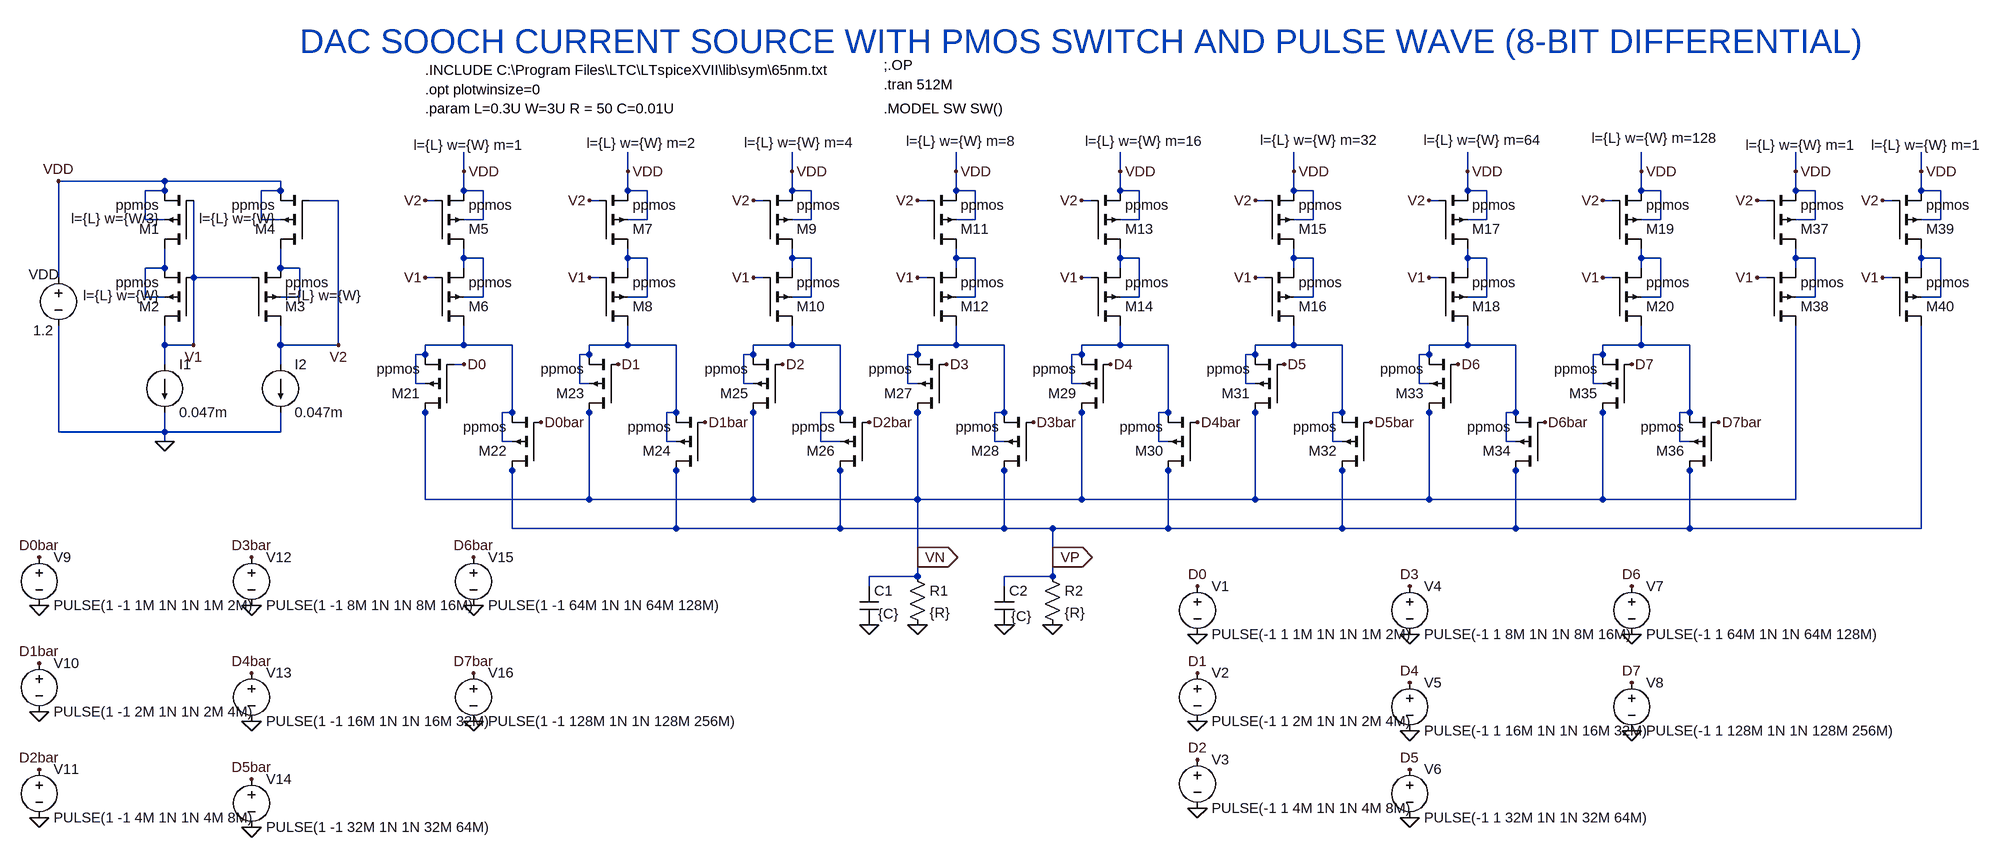
[diagram p0: schematic 106DAC_DIFF_SOOCH_PMOS_SW_PULSE_8BIT.asc]
106DAC_DIFF_SOOCH_PMOS_SW_PULSE_8BIT.asc, the LTspice schematic file:
Version 4
SHEET 1 2324 848
WIRE -512 -320 -512 -352
WIRE -240 -320 -240 -352
WIRE 32 -320 32 -352
WIRE 304 -320 304 -352
WIRE 576 -320 576 -352
WIRE 864 -320 864 -352
WIRE 1152 -320 1152 -352
WIRE 1440 -320 1440 -352
WIRE 1696 -320 1696 -352
WIRE 1904 -320 1904 -352
WIRE -1008 -304 -1184 -304
WIRE -816 -304 -1008 -304
WIRE -1008 -288 -1008 -304
WIRE -1008 -288 -1040 -288
WIRE -816 -288 -816 -304
WIRE -816 -288 -848 -288
WIRE -512 -288 -512 -320
WIRE -480 -288 -512 -288
WIRE -240 -288 -240 -320
WIRE -208 -288 -240 -288
WIRE 32 -288 32 -320
WIRE 64 -288 32 -288
WIRE 304 -288 304 -320
WIRE 336 -288 304 -288
WIRE 576 -288 576 -320
WIRE 608 -288 576 -288
WIRE 864 -288 864 -320
WIRE 896 -288 864 -288
WIRE 1152 -288 1152 -320
WIRE 1184 -288 1152 -288
WIRE 1440 -288 1440 -320
WIRE 1472 -288 1440 -288
WIRE 1696 -288 1696 -320
WIRE 1728 -288 1696 -288
WIRE 1904 -288 1904 -320
WIRE 1936 -288 1904 -288
WIRE -720 -272 -768 -272
WIRE -560 -272 -576 -272
WIRE -288 -272 -304 -272
WIRE -16 -272 -32 -272
WIRE 256 -272 240 -272
WIRE 528 -272 512 -272
WIRE 816 -272 800 -272
WIRE 1104 -272 1088 -272
WIRE 1392 -272 1376 -272
WIRE 1648 -272 1632 -272
WIRE 1856 -272 1840 -272
WIRE -1040 -240 -1040 -288
WIRE -1008 -240 -1040 -240
WIRE -848 -240 -848 -288
WIRE -816 -240 -848 -240
WIRE -480 -240 -480 -288
WIRE -480 -240 -512 -240
WIRE -208 -240 -208 -288
WIRE -208 -240 -240 -240
WIRE 64 -240 64 -288
WIRE 64 -240 32 -240
WIRE 336 -240 336 -288
WIRE 336 -240 304 -240
WIRE 608 -240 608 -288
WIRE 608 -240 576 -240
WIRE 896 -240 896 -288
WIRE 896 -240 864 -240
WIRE 1184 -240 1184 -288
WIRE 1184 -240 1152 -240
WIRE 1472 -240 1472 -288
WIRE 1472 -240 1440 -240
WIRE 1728 -240 1728 -288
WIRE 1728 -240 1696 -240
WIRE 1936 -240 1936 -288
WIRE 1936 -240 1904 -240
WIRE -512 -176 -512 -192
WIRE -480 -176 -512 -176
WIRE -240 -176 -240 -192
WIRE -208 -176 -240 -176
WIRE 32 -176 32 -192
WIRE 64 -176 32 -176
WIRE 304 -176 304 -192
WIRE 336 -176 304 -176
WIRE 576 -176 576 -192
WIRE 608 -176 576 -176
WIRE 864 -176 864 -192
WIRE 896 -176 864 -176
WIRE 1152 -176 1152 -192
WIRE 1184 -176 1152 -176
WIRE 1440 -176 1440 -192
WIRE 1472 -176 1440 -176
WIRE 1696 -176 1696 -192
WIRE 1728 -176 1696 -176
WIRE 1904 -176 1904 -192
WIRE 1936 -176 1904 -176
WIRE -1008 -160 -1008 -192
WIRE -1008 -160 -1040 -160
WIRE -816 -160 -816 -192
WIRE -784 -160 -816 -160
WIRE -512 -160 -512 -176
WIRE -240 -160 -240 -176
WIRE 32 -160 32 -176
WIRE 304 -160 304 -176
WIRE 576 -160 576 -176
WIRE 864 -160 864 -176
WIRE 1152 -160 1152 -176
WIRE 1440 -160 1440 -176
WIRE 1696 -160 1696 -176
WIRE 1904 -160 1904 -176
WIRE -1184 -144 -1184 -304
WIRE -960 -144 -960 -272
WIRE -864 -144 -960 -144
WIRE -560 -144 -576 -144
WIRE -288 -144 -304 -144
WIRE -16 -144 -32 -144
WIRE 256 -144 240 -144
WIRE 528 -144 512 -144
WIRE 816 -144 800 -144
WIRE 1104 -144 1088 -144
WIRE 1392 -144 1376 -144
WIRE 1648 -144 1632 -144
WIRE 1856 -144 1840 -144
WIRE -1040 -112 -1040 -160
WIRE -1008 -112 -1040 -112
WIRE -784 -112 -784 -160
WIRE -784 -112 -816 -112
WIRE -480 -112 -480 -176
WIRE -480 -112 -512 -112
WIRE -208 -112 -208 -176
WIRE -208 -112 -240 -112
WIRE 64 -112 64 -176
WIRE 64 -112 32 -112
WIRE 336 -112 336 -176
WIRE 336 -112 304 -112
WIRE 608 -112 608 -176
WIRE 608 -112 576 -112
WIRE 896 -112 896 -176
WIRE 896 -112 864 -112
WIRE 1184 -112 1184 -176
WIRE 1184 -112 1152 -112
WIRE 1472 -112 1472 -176
WIRE 1472 -112 1440 -112
WIRE 1728 -112 1728 -176
WIRE 1728 -112 1696 -112
WIRE 1936 -112 1936 -176
WIRE 1936 -112 1904 -112
WIRE -1008 -32 -1008 -64
WIRE -960 -32 -960 -144
WIRE -960 -32 -1008 -32
WIRE -816 -32 -816 -64
WIRE -720 -32 -720 -272
WIRE -720 -32 -816 -32
WIRE -512 -32 -512 -64
WIRE -512 -32 -576 -32
WIRE -432 -32 -512 -32
WIRE -240 -32 -240 -64
WIRE -240 -32 -304 -32
WIRE -160 -32 -240 -32
WIRE 32 -32 32 -64
WIRE 32 -32 -32 -32
WIRE 112 -32 32 -32
WIRE 304 -32 304 -64
WIRE 304 -32 240 -32
WIRE 384 -32 304 -32
WIRE 576 -32 576 -64
WIRE 576 -32 512 -32
WIRE 656 -32 576 -32
WIRE 864 -32 864 -64
WIRE 864 -32 800 -32
WIRE 944 -32 864 -32
WIRE 1152 -32 1152 -64
WIRE 1152 -32 1088 -32
WIRE 1232 -32 1152 -32
WIRE 1440 -32 1440 -64
WIRE 1440 -32 1376 -32
WIRE 1520 -32 1440 -32
WIRE -576 -16 -576 -32
WIRE -576 -16 -592 -16
WIRE -304 -16 -304 -32
WIRE -304 -16 -320 -16
WIRE -32 -16 -32 -32
WIRE -32 -16 -48 -16
WIRE 240 -16 240 -32
WIRE 240 -16 224 -16
WIRE 512 -16 512 -32
WIRE 512 -16 496 -16
WIRE 800 -16 800 -32
WIRE 800 -16 784 -16
WIRE 1088 -16 1088 -32
WIRE 1088 -16 1072 -16
WIRE 1376 -16 1376 -32
WIRE 1376 -16 1360 -16
WIRE -1008 0 -1008 -32
WIRE -816 0 -816 -32
WIRE -512 0 -528 0
WIRE -592 32 -592 -16
WIRE -576 32 -592 32
WIRE -320 32 -320 -16
WIRE -304 32 -320 32
WIRE -48 32 -48 -16
WIRE -32 32 -48 32
WIRE 224 32 224 -16
WIRE 240 32 224 32
WIRE 496 32 496 -16
WIRE 512 32 496 32
WIRE 784 32 784 -16
WIRE 800 32 784 32
WIRE 1072 32 1072 -16
WIRE 1088 32 1072 32
WIRE 1360 32 1360 -16
WIRE 1376 32 1360 32
WIRE -576 80 -576 64
WIRE -432 80 -432 -32
WIRE -432 80 -448 80
WIRE -304 80 -304 64
WIRE -160 80 -160 -32
WIRE -160 80 -176 80
WIRE -32 80 -32 64
WIRE 112 80 112 -32
WIRE 112 80 80 80
WIRE 240 80 240 64
WIRE 384 80 384 -32
WIRE 384 80 368 80
WIRE 512 80 512 64
WIRE 656 80 656 -32
WIRE 656 80 640 80
WIRE 800 80 800 64
WIRE 944 80 944 -32
WIRE 944 80 928 80
WIRE 1088 80 1088 64
WIRE 1232 80 1232 -32
WIRE 1232 80 1216 80
WIRE 1376 80 1376 64
WIRE 1520 80 1520 -32
WIRE 1520 80 1504 80
WIRE -1184 112 -1184 -64
WIRE -1008 112 -1008 80
WIRE -1008 112 -1184 112
WIRE -816 112 -816 80
WIRE -816 112 -1008 112
WIRE -1008 128 -1008 112
WIRE -448 128 -448 80
WIRE -432 128 -448 128
WIRE -176 128 -176 80
WIRE -160 128 -176 128
WIRE 80 128 80 80
WIRE 112 128 80 128
WIRE 368 128 368 80
WIRE 384 128 368 128
WIRE 640 128 640 80
WIRE 656 128 640 128
WIRE 928 128 928 80
WIRE 944 128 928 128
WIRE 1216 128 1216 80
WIRE 1232 128 1216 128
WIRE 1504 128 1504 80
WIRE 1520 128 1504 128
WIRE -432 176 -432 160
WIRE -160 176 -160 160
WIRE 112 176 112 160
WIRE 384 176 384 160
WIRE 656 176 656 160
WIRE 944 176 944 160
WIRE 1232 176 1232 160
WIRE 1520 176 1520 160
WIRE -576 224 -576 80
WIRE -304 224 -304 80
WIRE -304 224 -576 224
WIRE -32 224 -32 80
WIRE -32 224 -304 224
WIRE 240 224 240 80
WIRE 240 224 -32 224
WIRE 512 224 512 80
WIRE 512 224 240 224
WIRE 800 224 800 80
WIRE 800 224 512 224
WIRE 1088 224 1088 80
WIRE 1088 224 800 224
WIRE 1376 224 1376 80
WIRE 1376 224 1088 224
WIRE 1696 224 1696 -64
WIRE 1696 224 1376 224
WIRE -432 272 -432 176
WIRE -160 272 -160 176
WIRE -160 272 -432 272
WIRE 112 272 112 176
WIRE 112 272 -160 272
WIRE 384 272 384 176
WIRE 384 272 112 272
WIRE 464 272 384 272
WIRE 656 272 656 176
WIRE 656 272 464 272
WIRE 944 272 944 176
WIRE 944 272 656 272
WIRE 1232 272 1232 176
WIRE 1232 272 944 272
WIRE 1520 272 1520 176
WIRE 1520 272 1232 272
WIRE 1904 272 1904 -64
WIRE 1904 272 1520 272
WIRE 240 320 240 224
WIRE 464 320 464 272
WIRE 240 352 240 320
WIRE 240 352 160 352
WIRE 464 352 464 320
WIRE 464 352 384 352
WIRE 160 368 160 352
WIRE 384 368 384 352
FLAG -960 -32 V1
FLAG -576 -144 V1
FLAG -720 -32 V2
FLAG -576 -272 V2
FLAG -512 -320 VDD
FLAG -1184 -304 VDD
FLAG -304 -144 V1
FLAG -304 -272 V2
FLAG -240 -320 VDD
FLAG -32 -144 V1
FLAG -32 -272 V2
FLAG 32 -320 VDD
FLAG 240 -144 V1
FLAG 240 -272 V2
FLAG 304 -320 VDD
FLAG 512 -144 V1
FLAG 512 -272 V2
FLAG 576 -320 VDD
FLAG 800 -144 V1
FLAG 800 -272 V2
FLAG 864 -320 VDD
FLAG 1088 -144 V1
FLAG 1088 -272 V2
FLAG 1152 -320 VDD
FLAG 1376 -144 V1
FLAG 1376 -272 V2
FLAG 1440 -320 VDD
FLAG 240 432 0
FLAG -256 0 D1
FLAG 16 0 D2
FLAG 288 0 D3
FLAG 560 0 D4
FLAG 848 0 D5
FLAG 1136 0 D6
FLAG 1424 0 D7
FLAG -1008 128 0
FLAG 704 448 0
FLAG 704 592 0
FLAG 704 736 0
FLAG 1056 448 0
FLAG 1056 608 0
FLAG 704 368 D0
FLAG 704 512 D1
FLAG 704 656 D2
FLAG 1056 368 D3
FLAG 1056 528 D4
FLAG 1056 752 0
FLAG 1424 448 0
FLAG 1424 608 0
FLAG 1056 672 D5
FLAG 1424 368 D6
FLAG 1424 528 D7
FLAG 160 432 0
FLAG -1216 400 0
FLAG -1216 576 0
FLAG -1216 752 0
FLAG -864 400 0
FLAG -864 592 0
FLAG -1216 320 D0bar
FLAG -1216 496 D1bar
FLAG -1216 672 D2bar
FLAG -864 320 D3bar
FLAG -864 512 D4bar
FLAG -864 768 0
FLAG -496 400 0
FLAG -496 592 0
FLAG -864 688 D5bar
FLAG -496 320 D6bar
FLAG -496 512 D7bar
FLAG -384 96 D0bar
FLAG -112 96 D1bar
FLAG 160 96 D2bar
FLAG 432 96 D3bar
FLAG 704 96 D4bar
FLAG 992 96 D5bar
FLAG 1280 96 D6bar
FLAG 1568 96 D7bar
FLAG 464 432 0
FLAG 464 320 VP
IOPIN 464 320 Out
FLAG 384 432 0
FLAG 240 320 VN
IOPIN 240 320 Out
FLAG -512 0 D0
FLAG 1632 -144 V1
FLAG 1632 -272 V2
FLAG 1696 -320 VDD
FLAG 1840 -144 V1
FLAG 1840 -272 V2
FLAG 1904 -320 VDD
SYMBOL pmos4 -960 -192 R180
WINDOW 123 56 50 Left 2
SYMATTR Value2 l={L} w={W/3}
SYMATTR InstName M1
SYMATTR Value ppmos
SYMBOL pmos4 -960 -64 R180
WINDOW 123 56 50 Left 2
SYMATTR Value2 l={L} w={W}
SYMATTR InstName M2
SYMATTR Value ppmos
SYMBOL current -1008 0 R0
WINDOW 123 0 0 Left 0
WINDOW 39 0 0 Left 0
SYMATTR InstName I1
SYMATTR Value 0.047m
SYMBOL pmos4 -864 -64 M180
WINDOW 123 56 50 Left 2
SYMATTR Value2 l={L} w={W}
SYMATTR InstName M3
SYMATTR Value ppmos
SYMBOL pmos4 -768 -192 R180
WINDOW 123 56 50 Left 2
SYMATTR Value2 l={L} w={W}
SYMATTR InstName M4
SYMATTR Value ppmos
SYMBOL current -816 0 R0
WINDOW 123 0 0 Left 0
WINDOW 39 0 0 Left 0
SYMATTR InstName I2
SYMATTR Value 0.047m
SYMBOL pmos4 -560 -192 M180
WINDOW 123 -35 172 Left 2
SYMATTR Value2 l={L} w={W} m=1
SYMATTR InstName M5
SYMATTR Value ppmos
SYMBOL pmos4 -560 -64 M180
SYMATTR Value2 l={L} w={W} m=1
SYMATTR InstName M6
SYMATTR Value ppmos
SYMBOL voltage -1184 -160 R0
WINDOW 123 0 0 Left 0
WINDOW 39 0 0 Left 0
WINDOW 0 -49 11 Left 2
WINDOW 3 -42 104 Left 2
SYMATTR InstName VDD
SYMATTR Value 1.2
SYMBOL pmos4 -288 -192 M180
WINDOW 123 -20 175 Left 2
SYMATTR Value2 l={L} w={W} m=2
SYMATTR InstName M7
SYMATTR Value ppmos
SYMBOL pmos4 -288 -64 M180
SYMATTR Value2 l={L} w={W} m=2
SYMATTR InstName M8
SYMATTR Value ppmos
SYMBOL pmos4 -16 -192 M180
WINDOW 123 -31 176 Left 2
SYMATTR Value2 l={L} w={W} m=4
SYMATTR InstName M9
SYMATTR Value ppmos
SYMBOL pmos4 -16 -64 M180
SYMATTR Value2 l={L} w={W} m=4
SYMATTR InstName M10
SYMATTR Value ppmos
SYMBOL pmos4 256 -192 M180
WINDOW 123 -35 178 Left 2
SYMATTR Value2 l={L} w={W} m=8
SYMATTR InstName M11
SYMATTR Value ppmos
SYMBOL pmos4 256 -64 M180
SYMATTR Value2 l={L} w={W} m=8
SYMATTR InstName M12
SYMATTR Value ppmos
SYMBOL pmos4 528 -192 M180
WINDOW 123 -10 178 Left 2
SYMATTR Value2 l={L} w={W} m=16
SYMATTR InstName M13
SYMATTR Value ppmos
SYMBOL pmos4 528 -64 M180
SYMATTR Value2 l={L} w={W} m=16
SYMATTR InstName M14
SYMATTR Value ppmos
SYMBOL pmos4 816 -192 M180
WINDOW 123 -8 180 Left 2
SYMATTR Value2 l={L} w={W} m=32
SYMATTR InstName M15
SYMATTR Value ppmos
SYMBOL pmos4 816 -64 M180
SYMATTR Value2 l={L} w={W} m=32
SYMATTR InstName M16
SYMATTR Value ppmos
SYMBOL pmos4 1104 -192 M180
WINDOW 123 -25 180 Left 2
SYMATTR Value2 l={L} w={W} m=64
SYMATTR InstName M17
SYMATTR Value ppmos
SYMBOL pmos4 1104 -64 M180
SYMATTR Value2 l={L} w={W} m=64
SYMATTR InstName M18
SYMATTR Value ppmos
SYMBOL pmos4 1392 -192 M180
WINDOW 123 -34 183 Left 2
SYMATTR Value2 l={L} w={W} m=128
SYMATTR InstName M19
SYMATTR Value ppmos
SYMBOL pmos4 1392 -64 M180
SYMATTR Value2 l={L} w={W} m=128
SYMATTR InstName M20
SYMATTR Value ppmos
SYMBOL res 224 336 R0
SYMATTR InstName R1
SYMATTR Value {R}
SYMBOL voltage 704 352 R0
WINDOW 123 0 0 Left 0
WINDOW 39 0 0 Left 0
SYMATTR InstName V1
SYMATTR Value PULSE(-1 1 1M 1N 1N 1M 2M)
SYMBOL voltage 704 496 R0
SYMATTR InstName V2
SYMATTR Value PULSE(-1 1 2M 1N 1N 2M 4M)
SYMBOL voltage 704 640 R0
SYMATTR InstName V3
SYMATTR Value PULSE(-1 1 4M 1N 1N 4M 8M)
SYMBOL voltage 1056 352 R0
SYMATTR InstName V4
SYMATTR Value PULSE(-1 1 8M 1N 1N 8M 16M)
SYMBOL voltage 1056 512 R0
SYMATTR InstName V5
SYMATTR Value PULSE(-1 1 16M 1N 1N 16M 32M)
SYMBOL voltage 1056 656 R0
SYMATTR InstName V6
SYMATTR Value PULSE(-1 1 32M 1N 1N 32M 64M)
SYMBOL voltage 1424 352 R0
SYMATTR InstName V7
SYMATTR Value PULSE(-1 1 64M 1N 1N 64M 128M)
SYMBOL voltage 1424 512 R0
SYMATTR InstName V8
SYMATTR Value PULSE(-1 1 128M 1N 1N 128M 256M)
SYMBOL cap 144 368 R0
WINDOW 3 31 46 Left 2
SYMATTR Value {C}
SYMATTR InstName C1
SYMBOL voltage -1216 304 R0
WINDOW 123 0 0 Left 0
WINDOW 39 0 0 Left 0
SYMATTR InstName V9
SYMATTR Value PULSE(1 -1 1M 1N 1N 1M 2M)
SYMBOL voltage -1216 480 R0
SYMATTR InstName V10
SYMATTR Value PULSE(1 -1 2M 1N 1N 2M 4M)
SYMBOL voltage -1216 656 R0
SYMATTR InstName V11
SYMATTR Value PULSE(1 -1 4M 1N 1N 4M 8M)
SYMBOL voltage -864 304 R0
SYMATTR InstName V12
SYMATTR Value PULSE(1 -1 8M 1N 1N 8M 16M)
SYMBOL voltage -864 496 R0
SYMATTR InstName V13
SYMATTR Value PULSE(1 -1 16M 1N 1N 16M 32M)
SYMBOL voltage -864 672 R0
SYMATTR InstName V14
SYMATTR Value PULSE(1 -1 32M 1N 1N 32M 64M)
SYMBOL voltage -496 304 R0
SYMATTR InstName V15
SYMATTR Value PULSE(1 -1 64M 1N 1N 64M 128M)
SYMBOL voltage -496 496 R0
SYMATTR InstName V16
SYMATTR Value PULSE(1 -1 128M 1N 1N 128M 256M)
SYMBOL res 448 336 R0
SYMATTR InstName R2
SYMATTR Value {R}
SYMBOL cap 368 368 R0
WINDOW 3 27 50 Left 2
SYMATTR Value {C}
SYMATTR InstName C2
SYMBOL pmos4 -528 80 R180
SYMATTR Value2 l={L} w={W} m=1
SYMATTR InstName M21
SYMATTR Value ppmos
SYMBOL pmos4 -384 176 R180
SYMATTR Value2 l={L} w={W} m=1
SYMATTR InstName M22
SYMATTR Value ppmos
SYMBOL pmos4 -256 80 R180
SYMATTR Value2 l={L} w={W} m=2
SYMATTR InstName M23
SYMATTR Value ppmos
SYMBOL pmos4 16 80 R180
SYMATTR Value2 l={L} w={W} m=4
SYMATTR InstName M25
SYMATTR Value ppmos
SYMBOL pmos4 160 176 R180
SYMATTR Value2 l={L} w={W} m=4
SYMATTR InstName M26
SYMATTR Value ppmos
SYMBOL pmos4 288 80 R180
SYMATTR Value2 l={L} w={W} m=8
SYMATTR InstName M27
SYMATTR Value ppmos
SYMBOL pmos4 432 176 R180
SYMATTR Value2 l={L} w={W} m=8
SYMATTR InstName M28
SYMATTR Value ppmos
SYMBOL pmos4 -112 176 R180
SYMATTR Value2 l={L} w={W} m=2
SYMATTR InstName M24
SYMATTR Value ppmos
SYMBOL pmos4 560 80 R180
SYMATTR Value2 l={L} w={W} m=16
SYMATTR InstName M29
SYMATTR Value ppmos
SYMBOL pmos4 704 176 R180
SYMATTR Value2 l={L} w={W} m=16
SYMATTR InstName M30
SYMATTR Value ppmos
SYMBOL pmos4 848 80 R180
SYMATTR Value2 l={L} w={W} m=32
SYMATTR InstName M31
SYMATTR Value ppmos
SYMBOL pmos4 992 176 R180
SYMATTR Value2 l={L} w={W} m=32
SYMATTR InstName M32
SYMATTR Value ppmos
SYMBOL pmos4 1136 80 R180
SYMATTR Value2 l={L} w={W} m=64
SYMATTR InstName M33
SYMATTR Value ppmos
SYMBOL pmos4 1280 176 R180
SYMATTR Value2 l={L} w={W} m=64
SYMATTR InstName M34
SYMATTR Value ppmos
SYMBOL pmos4 1424 80 R180
SYMATTR Value2 l={L} w={W} m=128
SYMATTR InstName M35
SYMATTR Value ppmos
SYMBOL pmos4 1568 176 R180
SYMATTR Value2 l={L} w={W} m=128
SYMATTR InstName M36
SYMATTR Value ppmos
SYMBOL pmos4 1648 -192 M180
WINDOW 123 -35 172 Left 2
SYMATTR Value2 l={L} w={W} m=1
SYMATTR InstName M37
SYMATTR Value ppmos
SYMBOL pmos4 1648 -64 M180
SYMATTR Value2 l={L} w={W} m=1
SYMATTR InstName M38
SYMATTR Value ppmos
SYMBOL pmos4 1856 -192 M180
WINDOW 123 -35 172 Left 2
SYMATTR Value2 l={L} w={W} m=1
SYMATTR InstName M39
SYMATTR Value ppmos
SYMBOL pmos4 1856 -64 M180
SYMATTR Value2 l={L} w={W} m=1
SYMATTR InstName M40
SYMATTR Value ppmos
TEXT -576 -488 Left 2 !.INCLUDE C:\\Program Files\\LTC\\LTspiceXVII\\lib\\sym\\65nm.txt
TEXT -576 -456 Left 2 !.opt plotwinsize=0
TEXT 184 -496 Left 2 !;.OP
TEXT -576 -424 Left 2 !.param L=0.3U W=3U R = 50 C=0.01U
TEXT 184 -464 Left 2 !.tran 512M
TEXT 184 -424 Left 2 !.MODEL SW SW()
TEXT -784 -536 Left 5 ;DAC SOOCH CURRENT SOURCE WITH PMOS SWITCH AND PULSE WAVE (8-BIT DIFFERENTIAL)

The netlist it stands for:
* 106DAC_DIFF_SOOCH_PMOS_SW_PULSE_8BIT.asc
M1 N011 V1 VDD VDD ppmos l={L} w={W/3}
M2 V1 V1 N011 N011 ppmos l={L} w={W}
I1 V1 0 0.047m
M3 V2 V1 N012 N012 ppmos l={L} w={W}
M4 N012 V2 VDD VDD ppmos l={L} w={W}
I2 V2 0 0.047m
M5 N001 V2 VDD VDD ppmos l={L} w={W} m=1
M6 N013 V1 N001 N001 ppmos l={L} w={W} m=1
VDD VDD 0 1.2
M7 N002 V2 VDD VDD ppmos l={L} w={W} m=2
M8 N014 V1 N002 N002 ppmos l={L} w={W} m=2
M9 N003 V2 VDD VDD ppmos l={L} w={W} m=4
M10 N015 V1 N003 N003 ppmos l={L} w={W} m=4
M11 N004 V2 VDD VDD ppmos l={L} w={W} m=8
M12 N016 V1 N004 N004 ppmos l={L} w={W} m=8
M13 N005 V2 VDD VDD ppmos l={L} w={W} m=16
M14 N017 V1 N005 N005 ppmos l={L} w={W} m=16
M15 N006 V2 VDD VDD ppmos l={L} w={W} m=32
M16 N018 V1 N006 N006 ppmos l={L} w={W} m=32
M17 N007 V2 VDD VDD ppmos l={L} w={W} m=64
M18 N019 V1 N007 N007 ppmos l={L} w={W} m=64
M19 N008 V2 VDD VDD ppmos l={L} w={W} m=128
M20 N020 V1 N008 N008 ppmos l={L} w={W} m=128
R1 VN 0 {R}
V1 D0 0 PULSE(-1 1 1M 1N 1N 1M 2M)
V2 D1 0 PULSE(-1 1 2M 1N 1N 2M 4M)
V3 D2 0 PULSE(-1 1 4M 1N 1N 4M 8M)
V4 D3 0 PULSE(-1 1 8M 1N 1N 8M 16M)
V5 D4 0 PULSE(-1 1 16M 1N 1N 16M 32M)
V6 D5 0 PULSE(-1 1 32M 1N 1N 32M 64M)
V7 D6 0 PULSE(-1 1 64M 1N 1N 64M 128M)
V8 D7 0 PULSE(-1 1 128M 1N 1N 128M 256M)
C1 VN 0 {C}
V9 D0bar 0 PULSE(1 -1 1M 1N 1N 1M 2M)
V10 D1bar 0 PULSE(1 -1 2M 1N 1N 2M 4M)
V11 D2bar 0 PULSE(1 -1 4M 1N 1N 4M 8M)
V12 D3bar 0 PULSE(1 -1 8M 1N 1N 8M 16M)
V13 D4bar 0 PULSE(1 -1 16M 1N 1N 16M 32M)
V14 D5bar 0 PULSE(1 -1 32M 1N 1N 32M 64M)
V15 D6bar 0 PULSE(1 -1 64M 1N 1N 64M 128M)
V16 D7bar 0 PULSE(1 -1 128M 1N 1N 128M 256M)
R2 VP 0 {R}
C2 VP 0 {C}
M21 VN D0 N013 N013 ppmos l={L} w={W} m=1
M22 VP D0bar N013 N013 ppmos l={L} w={W} m=1
M23 VN D1 N014 N014 ppmos l={L} w={W} m=2
M25 VN D2 N015 N015 ppmos l={L} w={W} m=4
M26 VP D2bar N015 N015 ppmos l={L} w={W} m=4
M27 VN D3 N016 N016 ppmos l={L} w={W} m=8
M28 VP D3bar N016 N016 ppmos l={L} w={W} m=8
M24 VP D1bar N014 N014 ppmos l={L} w={W} m=2
M29 VN D4 N017 N017 ppmos l={L} w={W} m=16
M30 VP D4bar N017 N017 ppmos l={L} w={W} m=16
M31 VN D5 N018 N018 ppmos l={L} w={W} m=32
M32 VP D5bar N018 N018 ppmos l={L} w={W} m=32
M33 VN D6 N019 N019 ppmos l={L} w={W} m=64
M34 VP D6bar N019 N019 ppmos l={L} w={W} m=64
M35 VN D7 N020 N020 ppmos l={L} w={W} m=128
M36 VP D7bar N020 N020 ppmos l={L} w={W} m=128
M37 N009 V2 VDD VDD ppmos l={L} w={W} m=1
M38 VN V1 N009 N009 ppmos l={L} w={W} m=1
M39 N010 V2 VDD VDD ppmos l={L} w={W} m=1
M40 VP V1 N010 N010 ppmos l={L} w={W} m=1
.model NMOS NMOS
.model PMOS PMOS
.lib standard.mos
.INCLUDE C:\Program Files\LTC\LTspiceXVII\lib\sym\65nm.txt
.opt plotwinsize=0
;.OP
.param L=0.3U W=3U R = 50 C=0.01U
.tran 512M
.MODEL SW SW()
* DAC SOOCH CURRENT SOURCE WITH PMOS SWITCH AND PULSE WAVE (8-BIT DIFFERENTIAL)
.backanno
.end